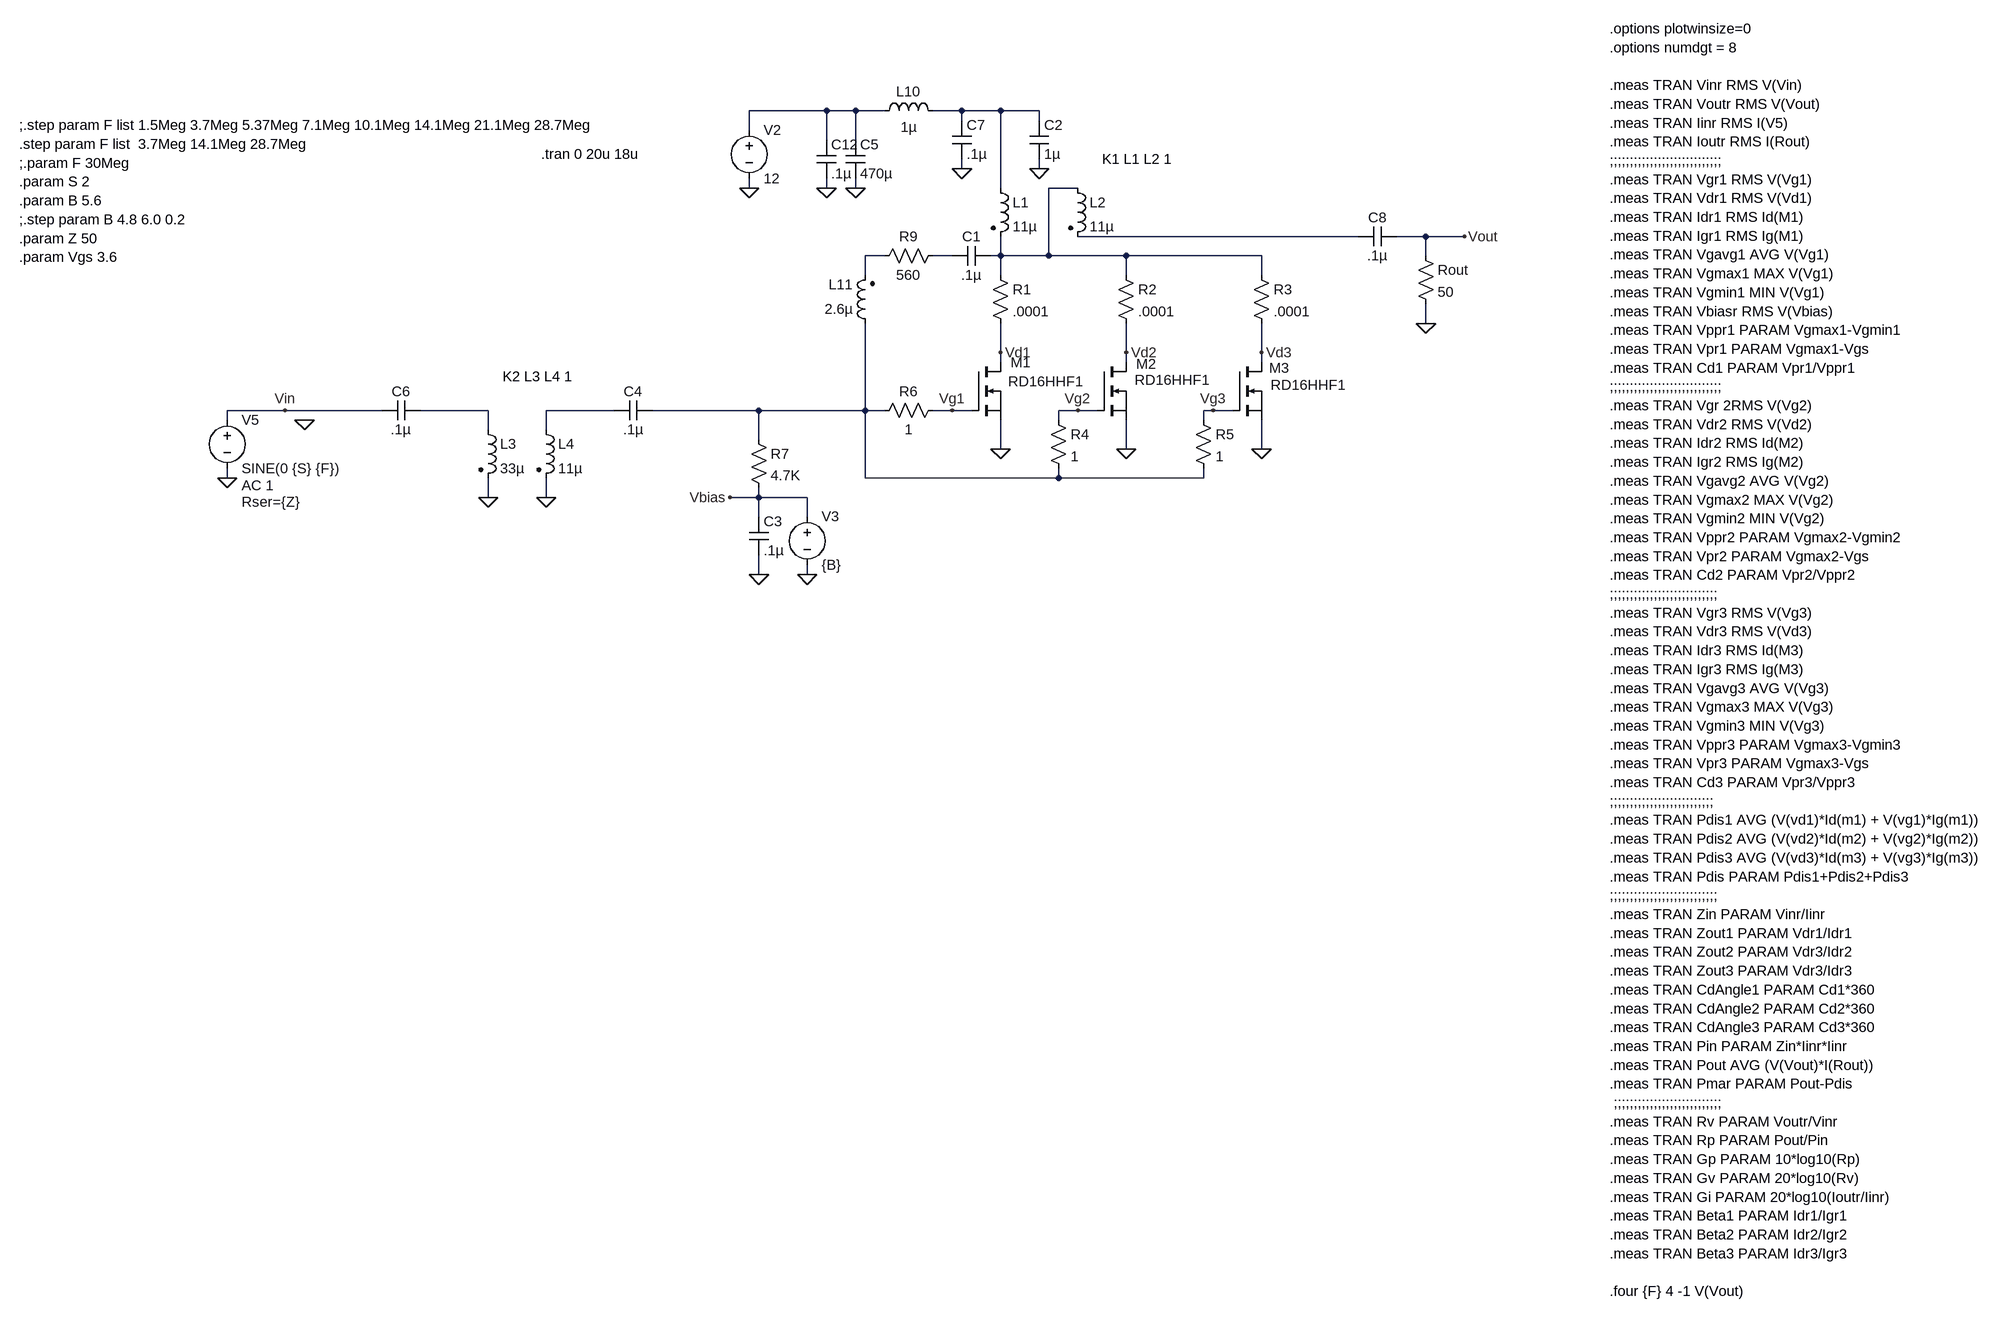
[diagram p0: schematic RD16HHF Parallel Testing Power Amp.asc]
RD16HHF Parallel Testing Power Amp.asc, the LTspice schematic file:
Version 4
SHEET 1 3060 1616
WIRE 1056 -400 928 -400
WIRE 1104 -400 1056 -400
WIRE 1152 -400 1104 -400
WIRE 1280 -400 1232 -400
WIRE 1344 -400 1280 -400
WIRE 1408 -400 1344 -400
WIRE 1280 -384 1280 -400
WIRE 1408 -384 1408 -400
WIRE 928 -368 928 -400
WIRE 1056 -352 1056 -400
WIRE 1104 -352 1104 -400
WIRE 1280 -304 1280 -320
WIRE 1408 -304 1408 -320
WIRE 928 -272 928 -288
WIRE 1056 -272 1056 -288
WIRE 1104 -272 1104 -288
WIRE 1344 -272 1344 -400
WIRE 1472 -272 1424 -272
WIRE 1936 -192 1472 -192
WIRE 2048 -192 2000 -192
WIRE 2112 -192 2048 -192
WIRE 1152 -160 1120 -160
WIRE 1264 -160 1232 -160
WIRE 1344 -160 1344 -192
WIRE 1344 -160 1328 -160
WIRE 1424 -160 1424 -272
WIRE 1424 -160 1344 -160
WIRE 1552 -160 1424 -160
WIRE 1776 -160 1552 -160
WIRE 2048 -160 2048 -192
WIRE 1120 -128 1120 -160
WIRE 1344 -128 1344 -160
WIRE 1552 -128 1552 -160
WIRE 1776 -128 1776 -160
WIRE 2048 -48 2048 -80
WIRE 1344 0 1344 -48
WIRE 1552 0 1552 -48
WIRE 1776 0 1776 -48
WIRE 1344 16 1344 0
WIRE 1552 16 1552 0
WIRE 1776 16 1776 0
WIRE 160 96 64 96
WIRE 320 96 160 96
WIRE 496 96 384 96
WIRE 704 96 592 96
WIRE 944 96 768 96
WIRE 1120 96 1120 -48
WIRE 1120 96 944 96
WIRE 1152 96 1120 96
WIRE 1264 96 1232 96
WIRE 1296 96 1264 96
WIRE 1472 96 1440 96
WIRE 1504 96 1472 96
WIRE 1696 96 1680 96
WIRE 1728 96 1696 96
WIRE 64 112 64 96
WIRE 1440 112 1440 96
WIRE 1680 112 1680 96
WIRE 496 128 496 96
WIRE 592 128 592 96
WIRE 944 144 944 96
WIRE 1344 160 1344 112
WIRE 1552 160 1552 112
WIRE 1776 160 1776 112
WIRE 64 208 64 192
WIRE 1120 208 1120 96
WIRE 1440 208 1440 192
WIRE 1440 208 1120 208
WIRE 1680 208 1680 192
WIRE 1680 208 1440 208
WIRE 496 240 496 208
WIRE 592 240 592 208
WIRE 944 240 944 224
WIRE 944 240 896 240
WIRE 1024 240 944 240
WIRE 944 272 944 240
WIRE 1024 272 1024 240
WIRE 944 368 944 336
WIRE 1024 368 1024 352
FLAG 928 -272 0
FLAG 1024 368 0
FLAG 1344 160 0
FLAG 1104 -272 0
FLAG 1280 -304 0
FLAG 1408 -304 0
FLAG 1056 -272 0
FLAG 2048 -48 0
FLAG 2112 -192 Vout
FLAG 1264 96 Vg1
FLAG 1344 0 Vd1
FLAG 64 208 0
FLAG 944 368 0
FLAG 160 96 Vin
FLAG 896 240 Vbias
FLAG 192 112 0
FLAG 1552 160 0
FLAG 1472 96 Vg2
FLAG 1552 0 Vd2
FLAG 1776 160 0
FLAG 1696 96 Vg3
FLAG 1776 0 Vd3
FLAG 496 240 0
FLAG 592 240 0
SYMBOL voltage 928 -384 R0
WINDOW 123 0 0 Left 2
WINDOW 39 0 0 Left 2
SYMATTR InstName V2
SYMATTR Value 12
SYMBOL cap 768 80 R90
WINDOW 0 0 32 VBottom 2
WINDOW 3 32 32 VTop 2
SYMATTR InstName C4
SYMATTR Value .1µ
SYMBOL voltage 1024 256 R0
WINDOW 123 0 0 Left 2
WINDOW 39 0 0 Left 2
SYMATTR InstName V3
SYMATTR Value {B}
SYMBOL res 928 128 R0
SYMATTR InstName R7
SYMATTR Value 4.7K
SYMBOL ind 1136 -384 R270
WINDOW 0 32 56 VTop 2
WINDOW 3 5 56 VBottom 2
SYMATTR InstName L10
SYMATTR Value 1µ
SYMBOL cap 1088 -352 R0
SYMATTR InstName C5
SYMATTR Value 470µ
SYMBOL cap 1264 -384 R0
SYMATTR InstName C7
SYMATTR Value .1µ
SYMBOL cap 1936 -176 R270
WINDOW 0 32 32 VTop 2
WINDOW 3 0 32 VBottom 2
SYMATTR InstName C8
SYMATTR Value .1µ
SYMBOL cap 1392 -384 R0
SYMATTR InstName C2
SYMATTR Value 1µ
SYMBOL cap 1040 -352 R0
SYMATTR InstName C12
SYMATTR Value .1µ
SYMBOL res 2032 -176 R0
SYMATTR InstName Rout
SYMATTR Value 50
SYMBOL voltage 64 96 R0
WINDOW 123 24 124 Left 2
WINDOW 39 24 152 Left 2
SYMATTR Value2 AC 1
SYMATTR SpiceLine Rser={Z}
SYMATTR InstName V5
SYMATTR Value SINE(0 {S} {F})
SYMBOL nmos 1296 16 R0
WINDOW 0 65 1 Left 2
WINDOW 3 61 32 Left 2
SYMATTR InstName M1
SYMATTR Value RD16HHF1
SYMBOL cap 928 272 R0
SYMATTR InstName C3
SYMATTR Value .1µ
SYMBOL ind2 1328 -288 R0
SYMATTR InstName L1
SYMATTR Value 11µ
SYMATTR Type ind
SYMBOL nmos 1504 16 R0
WINDOW 0 65 3 Left 2
WINDOW 3 62 30 Left 2
SYMATTR InstName M2
SYMATTR Value RD16HHF1
SYMBOL nmos 1728 16 R0
WINDOW 0 61 10 Left 2
WINDOW 3 63 38 Left 2
SYMATTR InstName M3
SYMATTR Value RD16HHF1
SYMBOL res 1328 -144 R0
SYMATTR InstName R1
SYMATTR Value .0001
SYMBOL res 1536 -144 R0
SYMATTR InstName R2
SYMATTR Value .0001
SYMBOL res 1760 -144 R0
SYMATTR InstName R3
SYMATTR Value .0001
SYMBOL res 1424 96 R0
SYMATTR InstName R4
SYMATTR Value 1
SYMBOL res 1664 96 R0
SYMATTR InstName R5
SYMATTR Value 1
SYMBOL res 1248 80 R90
WINDOW 0 0 56 VBottom 2
WINDOW 3 32 56 VTop 2
SYMATTR InstName R6
SYMATTR Value 1
SYMBOL cap 1328 -176 R90
WINDOW 0 0 32 VBottom 2
WINDOW 3 32 32 VTop 2
SYMATTR InstName C1
SYMATTR Value .1µ
SYMBOL res 1248 -176 R90
WINDOW 0 0 56 VBottom 2
WINDOW 3 32 56 VTop 2
SYMATTR InstName R9
SYMATTR Value 560
SYMBOL ind2 1136 -32 R180
WINDOW 0 36 80 Left 2
WINDOW 3 36 40 Left 2
SYMATTR InstName L11
SYMATTR Value 2.6µ
SYMATTR Type ind
SYMBOL ind2 1456 -288 R0
SYMATTR InstName L2
SYMATTR Value 11µ
SYMATTR Type ind
SYMBOL ind2 480 112 R0
SYMATTR InstName L3
SYMATTR Value 33µ
SYMATTR Type ind
SYMBOL ind2 576 112 R0
SYMATTR InstName L4
SYMATTR Value 11µ
SYMATTR Type ind
SYMBOL cap 384 80 R90
WINDOW 0 0 32 VBottom 2
WINDOW 3 32 32 VTop 2
SYMATTR InstName C6
SYMATTR Value .1µ
TEXT 584 -328 Left 2 !.tran 0 20u 18u
TEXT 2352 -536 Left 2 !.options plotwinsize=0\n.options numdgt = 8\n \n.meas TRAN Vinr RMS V(Vin)\n.meas TRAN Voutr RMS V(Vout)\n.meas TRAN Iinr RMS I(V5)\n.meas TRAN Ioutr RMS I(Rout)\n;;;;;;;;;;;;;;;;;;;;;;;;;;;;\n.meas TRAN Vgr1 RMS V(Vg1)\n.meas TRAN Vdr1 RMS V(Vd1)\n.meas TRAN Idr1 RMS Id(M1)\n.meas TRAN Igr1 RMS Ig(M1)\n.meas TRAN Vgavg1 AVG V(Vg1)\n.meas TRAN Vgmax1 MAX V(Vg1)\n.meas TRAN Vgmin1 MIN V(Vg1)\n.meas TRAN Vbiasr RMS V(Vbias)\n.meas TRAN Vppr1 PARAM Vgmax1-Vgmin1\n.meas TRAN Vpr1 PARAM Vgmax1-Vgs\n.meas TRAN Cd1 PARAM Vpr1/Vppr1\n;;;;;;;;;;;;;;;;;;;;;;;;;;;;\n.meas TRAN Vgr 2RMS V(Vg2)\n.meas TRAN Vdr2 RMS V(Vd2)\n.meas TRAN Idr2 RMS Id(M2)\n.meas TRAN Igr2 RMS Ig(M2)\n.meas TRAN Vgavg2 AVG V(Vg2)\n.meas TRAN Vgmax2 MAX V(Vg2)\n.meas TRAN Vgmin2 MIN V(Vg2)\n.meas TRAN Vppr2 PARAM Vgmax2-Vgmin2\n.meas TRAN Vpr2 PARAM Vgmax2-Vgs\n.meas TRAN Cd2 PARAM Vpr2/Vppr2\n;;;;;;;;;;;;;;;;;;;;;;;;;;;\n.meas TRAN Vgr3 RMS V(Vg3)\n.meas TRAN Vdr3 RMS V(Vd3)\n.meas TRAN Idr3 RMS Id(M3)\n.meas TRAN Igr3 RMS Ig(M3)\n.meas TRAN Vgavg3 AVG V(Vg3)\n.meas TRAN Vgmax3 MAX V(Vg3)\n.meas TRAN Vgmin3 MIN V(Vg3)\n.meas TRAN Vppr3 PARAM Vgmax3-Vgmin3\n.meas TRAN Vpr3 PARAM Vgmax3-Vgs\n.meas TRAN Cd3 PARAM Vpr3/Vppr3\n;;;;;;;;;;;;;;;;;;;;;;;;;;\n.meas TRAN Pdis1 AVG (V(vd1)*Id(m1) + V(vg1)*Ig(m1))\n.meas TRAN Pdis2 AVG (V(vd2)*Id(m2) + V(vg2)*Ig(m2))\n.meas TRAN Pdis3 AVG (V(vd3)*Id(m3) + V(vg3)*Ig(m3))\n.meas TRAN Pdis PARAM Pdis1+Pdis2+Pdis3\n;;;;;;;;;;;;;;;;;;;;;;;;;;;\n.meas TRAN Zin PARAM Vinr/Iinr\n.meas TRAN Zout1 PARAM Vdr1/Idr1\n.meas TRAN Zout2 PARAM Vdr3/Idr2\n.meas TRAN Zout3 PARAM Vdr3/Idr3\n.meas TRAN CdAngle1 PARAM Cd1*360\n.meas TRAN CdAngle2 PARAM Cd2*360\n.meas TRAN CdAngle3 PARAM Cd3*360\n.meas TRAN Pin PARAM Zin*Iinr*Iinr\n.meas TRAN Pout AVG (V(Vout)*I(Rout))\n.meas TRAN Pmar PARAM Pout-Pdis\n ;;;;;;;;;;;;;;;;;;;;;;;;;;;\n.meas TRAN Rv PARAM Voutr/Vinr\n.meas TRAN Rp PARAM Pout/Pin\n.meas TRAN Gp PARAM 10*log10(Rp)\n.meas TRAN Gv PARAM 20*log10(Rv)\n.meas TRAN Gi PARAM 20*log10(Ioutr/Iinr)\n.meas TRAN Beta1 PARAM Idr1/Igr1\n.meas TRAN Beta2 PARAM Idr2/Igr2\n.meas TRAN Beta3 PARAM Idr3/Igr3\n \n.four {F} 4 -1 V(Vout)
TEXT -280 -376 Left 2 !;.step param F list 1.5Meg 3.7Meg 5.37Meg 7.1Meg 10.1Meg 14.1Meg 21.1Meg 28.7Meg\n.step param F list  3.7Meg 14.1Meg 28.7Meg\n;.param F 30Meg\n.param S 2\n.param B 5.6\n;.step param B 4.8 6.0 0.2\n.param Z 50\n.param Vgs 3.6
TEXT 1512 -320 Left 2 !K1 L1 L2 1
TEXT 520 40 Left 2 !K2 L3 L4 1

The netlist it stands for:
* RD16HHF Parallel Testing Power Amp.asc
V2 N001 0 12
C4 N009 N008 .1µ
V3 Vbias 0 {B}
R7 N009 Vbias 4.7K
L10 N001 N002 1µ
C5 N001 0 470µ
C7 N002 0 .1µ
C8 N004 Vout .1µ
C2 N002 0 1µ
C12 N001 0 .1µ
Rout Vout 0 50
V5 Vin 0 SINE(0 {S} {F}) AC 1 Rser={Z}
M1 Vd1 Vg1 0 0 RD16HHF1
C3 Vbias 0 .1µ
L1 N002 N003 11µ
M2 Vd2 Vg2 0 0 RD16HHF1
M3 Vd3 Vg3 0 0 RD16HHF1
R1 N003 Vd1 .0001
R2 N003 Vd2 .0001
R3 N003 Vd3 .0001
R4 Vg2 N009 1
R5 Vg3 N009 1
R6 Vg1 N009 1
C1 N003 N006 .1µ
R9 N006 N005 560
L11 N009 N005 2.6µ
L2 N003 N004 11µ
L3 N007 0 33µ
L4 N008 0 11µ
C6 N007 Vin .1µ
.model NMOS NMOS
.model PMOS PMOS
.lib standard.mos
.tran 0 20u 18u
.options plotwinsize=0
.options numdgt = 8
.meas TRAN Vinr RMS V(Vin)
.meas TRAN Voutr RMS V(Vout)
.meas TRAN Iinr RMS I(V5)
.meas TRAN Ioutr RMS I(Rout)
;;;;;;;;;;;;;;;;;;;;;;;;;;;;
.meas TRAN Vgr1 RMS V(Vg1)
.meas TRAN Vdr1 RMS V(Vd1)
.meas TRAN Idr1 RMS Id(M1)
.meas TRAN Igr1 RMS Ig(M1)
.meas TRAN Vgavg1 AVG V(Vg1)
.meas TRAN Vgmax1 MAX V(Vg1)
.meas TRAN Vgmin1 MIN V(Vg1)
.meas TRAN Vbiasr RMS V(Vbias)
.meas TRAN Vppr1 PARAM Vgmax1-Vgmin1
.meas TRAN Vpr1 PARAM Vgmax1-Vgs
.meas TRAN Cd1 PARAM Vpr1/Vppr1
;;;;;;;;;;;;;;;;;;;;;;;;;;;;
.meas TRAN Vgr 2RMS V(Vg2)
.meas TRAN Vdr2 RMS V(Vd2)
.meas TRAN Idr2 RMS Id(M2)
.meas TRAN Igr2 RMS Ig(M2)
.meas TRAN Vgavg2 AVG V(Vg2)
.meas TRAN Vgmax2 MAX V(Vg2)
.meas TRAN Vgmin2 MIN V(Vg2)
.meas TRAN Vppr2 PARAM Vgmax2-Vgmin2
.meas TRAN Vpr2 PARAM Vgmax2-Vgs
.meas TRAN Cd2 PARAM Vpr2/Vppr2
;;;;;;;;;;;;;;;;;;;;;;;;;;;
.meas TRAN Vgr3 RMS V(Vg3)
.meas TRAN Vdr3 RMS V(Vd3)
.meas TRAN Idr3 RMS Id(M3)
.meas TRAN Igr3 RMS Ig(M3)
.meas TRAN Vgavg3 AVG V(Vg3)
.meas TRAN Vgmax3 MAX V(Vg3)
.meas TRAN Vgmin3 MIN V(Vg3)
.meas TRAN Vppr3 PARAM Vgmax3-Vgmin3
.meas TRAN Vpr3 PARAM Vgmax3-Vgs
.meas TRAN Cd3 PARAM Vpr3/Vppr3
;;;;;;;;;;;;;;;;;;;;;;;;;;
.meas TRAN Pdis1 AVG (V(vd1)*Id(m1) + V(vg1)*Ig(m1))
.meas TRAN Pdis2 AVG (V(vd2)*Id(m2) + V(vg2)*Ig(m2))
.meas TRAN Pdis3 AVG (V(vd3)*Id(m3) + V(vg3)*Ig(m3))
.meas TRAN Pdis PARAM Pdis1+Pdis2+Pdis3
;;;;;;;;;;;;;;;;;;;;;;;;;;;
.meas TRAN Zin PARAM Vinr/Iinr
.meas TRAN Zout1 PARAM Vdr1/Idr1
.meas TRAN Zout2 PARAM Vdr3/Idr2
.meas TRAN Zout3 PARAM Vdr3/Idr3
.meas TRAN CdAngle1 PARAM Cd1*360
.meas TRAN CdAngle2 PARAM Cd2*360
.meas TRAN CdAngle3 PARAM Cd3*360
.meas TRAN Pin PARAM Zin*Iinr*Iinr
.meas TRAN Pout AVG (V(Vout)*I(Rout))
.meas TRAN Pmar PARAM Pout-Pdis
 ;;;;;;;;;;;;;;;;;;;;;;;;;;;
.meas TRAN Rv PARAM Voutr/Vinr
.meas TRAN Rp PARAM Pout/Pin
.meas TRAN Gp PARAM 10*log10(Rp)
.meas TRAN Gv PARAM 20*log10(Rv)
.meas TRAN Gi PARAM 20*log10(Ioutr/Iinr)
.meas TRAN Beta1 PARAM Idr1/Igr1
.meas TRAN Beta2 PARAM Idr2/Igr2
.meas TRAN Beta3 PARAM Idr3/Igr3
.four {F} 4 -1 V(Vout)
;.step param F list 1.5Meg 3.7Meg 5.37Meg 7.1Meg 10.1Meg 14.1Meg 21.1Meg 28.7Meg
.step param F list  3.7Meg 14.1Meg 28.7Meg
;.param F 30Meg
.param S 2
.param B 5.6
;.step param B 4.8 6.0 0.2
.param Z 50
.param Vgs 3.6
K1 L1 L2 1
K2 L3 L4 1
.backanno
.end